# Altium schematic sheet SimpleFOCDriver.SchDoc
size A4
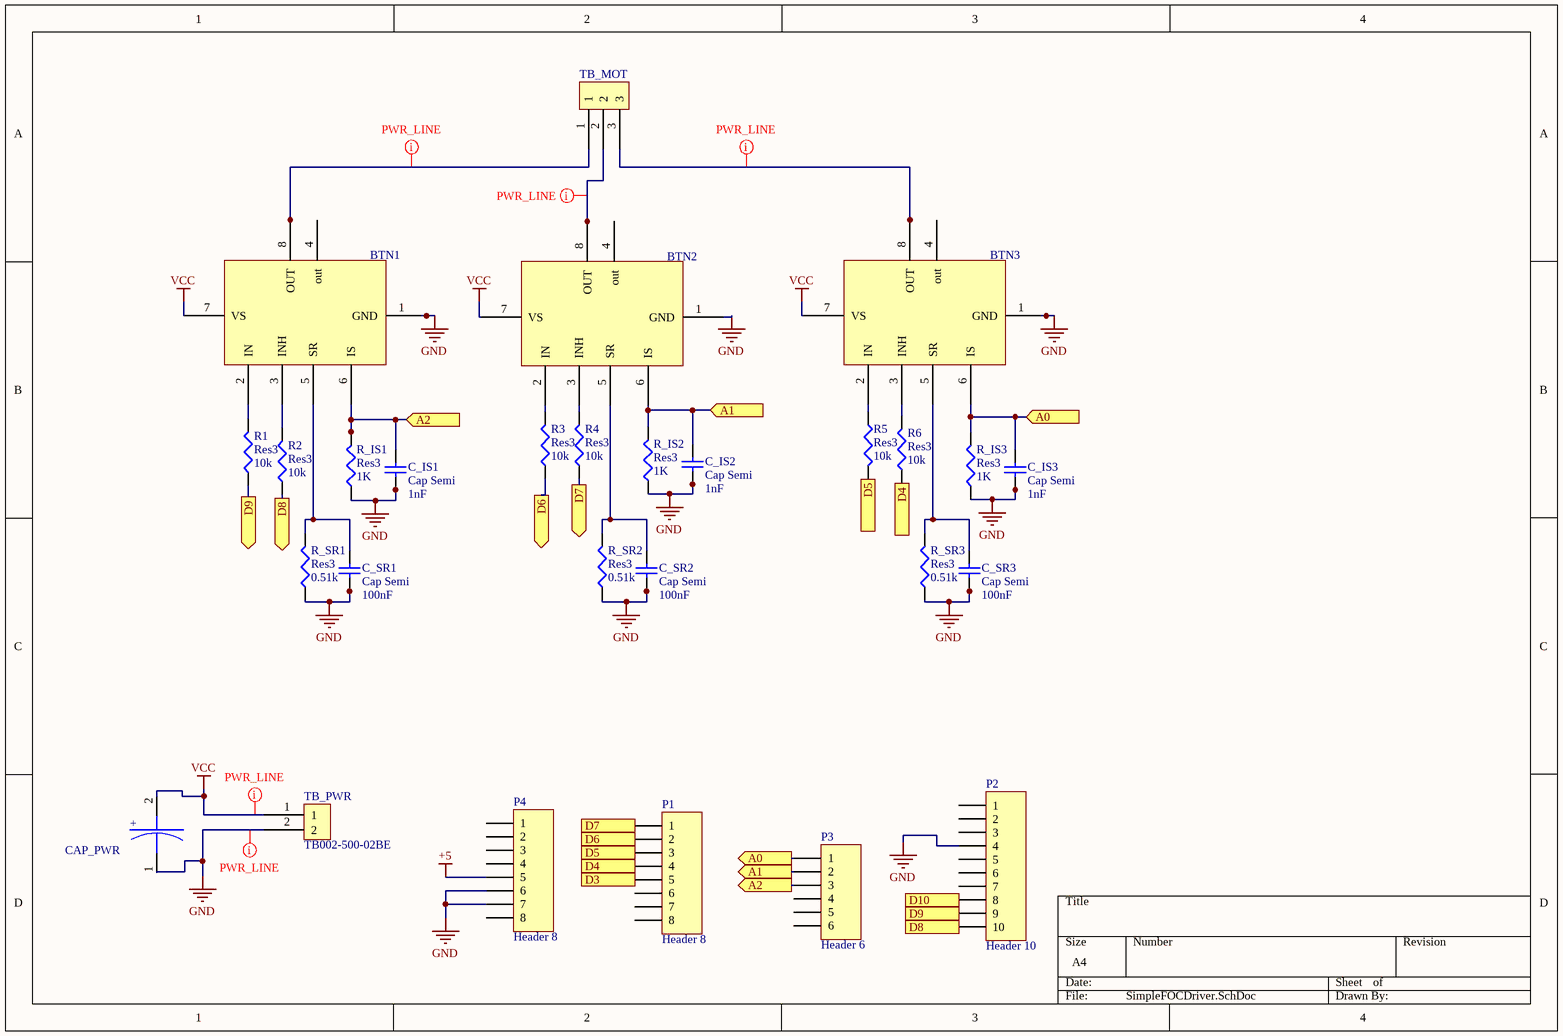
[diagram p0: SimpleFOCDriver.SchDoc]

## Parts
BTN1  BTN8982  [BTN8982]  (value not drawn)
BTN2  BTN8982  [BTN8982]  (value not drawn)
BTN3  BTN8982  [BTN8982]  (value not drawn)
C_IS1  Cap Semi  value 1nF  [1608[0603]]
C_IS2  Cap Semi  value 1nF  [1608[0603]]
C_IS3  Cap Semi  value 1nF  [1608[0603]]
C_SR1  Cap Semi  value 100nF  [1608[0603]]
C_SR2  Cap Semi  value 100nF  [1608[0603]]
C_SR3  Cap Semi  value 100nF  [1608[0603]]
CAP_PWR  VEJ471M1ETR1010  [VEJ471M1ETR1010]  (value not drawn)
P1  Header 8  [HDR1X8]
P2  Header 10  [HDR1X10]
P3  Header 6  [HDR1X6]
P4  Header 8  [HDR1X8]
R1  Res3  value 10k  [J1-0603]
R2  Res3  value 10k  [J1-0603]
R3  Res3  value 10k  [J1-0603]
R4  Res3  value 10k  [J1-0603]
R5  Res3  value 10k  [J1-0603]
R6  Res3  value 10k  [J1-0603]
R_IS1  Res3  value 1K  [J1-0603]
R_IS2  Res3  value 1K  [J1-0603]
R_IS3  Res3  value 1K  [J1-0603]
R_SR1  Res3  value 0.51k  [J1-0603]
R_SR2  Res3  value 0.51k  [J1-0603]
R_SR3  Res3  value 0.51k  [J1-0603]
TB_MOT  TB002-500-03BE  [TB002-500-03BE]  (value not drawn)
TB_PWR  TB002-500-02BE  [TB002-500-02BE]

## Ports
A0 (in), A0 (out), A1 (in), A1 (out), A2 (in), A2 (out), D3 (out), D4 (out), D5 (out), D6 (out), D7 (out), D8 (out), D9 (out), D10 (out)

## Nets
+5: P4.5
GND: BTN1.1(GND) BTN2.1(GND) BTN3.1(GND) C_IS1.1 C_IS2.1 C_IS3.1 C_SR1.1 C_SR2.1 C_SR3.1 CAP_PWR.1 P2.4 P4.6 P4.7 R_IS1.1 R_IS2.1 R_IS3.1 R_SR1.1 R_SR2.1 R_SR3.1 TB_PWR.2
VCC: BTN1.7(VS) BTN2.7(VS) BTN3.7(VS) CAP_PWR.2(+) TB_PWR.1
A0: BTN3.6(IS) C_IS3.2 P3.1 R_IS3.2 ; port A0
A1: BTN2.6(IS) C_IS2.2 P3.2 R_IS2.2 ; port A1
A2: BTN1.6(IS) C_IS1.2 P3.3 R_IS1.2 ; port A2
D3: P1.5 ; port D3
D4: P1.4 R6.1 ; port D4
D5: P1.3 R5.2 ; port D5
D6: P1.2 R3.1 ; port D6
D7: P1.1 R4.1 ; port D7
D8: P2.10 R2.1 ; port D8
D9: P2.9 R1.1 ; port D9
D10: P2.8 ; port D10
NetBTN1_2: BTN1.2(IN) R1.2
NetBTN1_3: BTN1.3(INH) R2.2
NetBTN1_5: BTN1.5(SR) C_SR1.2 R_SR1.2
NetBTN1_8: BTN1.8(OUT) TB_MOT.1
NetBTN2_2: BTN2.2(IN) R3.2
NetBTN2_3: BTN2.3(INH) R4.2
NetBTN2_5: BTN2.5(SR) C_SR2.2 R_SR2.2
NetBTN2_8: BTN2.8(OUT) TB_MOT.2
NetBTN3_2: BTN3.2(IN) R5.1
NetBTN3_3: BTN3.3(INH) R6.2
NetBTN3_5: BTN3.5(SR) C_SR3.2 R_SR3.2
NetBTN3_8: BTN3.8(OUT) TB_MOT.3

Not connected (* = marked no-connect by the designer): BTN1 4(out); BTN2 4(out); BTN3 4(out); P1 6 7 8; P2 1 2 3 5 6 7; P3 4 5 6; P4 1 2 3 4 8

## Layout directives
net class pwr_line: GND, NetBTN1_8, NetBTN2_8, NetBTN3_8, VCC

## Library data of the parts
C_IS1-C_IS3 C_SR1-C_SR3 = Cap Semi: Capacitor (Semiconductor SIM Model); Published: 8-Jun-2000; LatestRevisionDate: 29-May-2009; LatestRevisionNote: IPC-7351 Footprint Added.; PackageReference: C1206; Publisher: Altium Limited; PackageDescription: Chip Capacitor
P1 P4 = Header 8: Header, 8-Pin; LatestRevisionDate: 17-Jul-2002; LatestRevisionNote: Re-released for DXP Platform.; Publisher: Altium Limited
P2 = Header 10: Header, 10-Pin; LatestRevisionDate: 17-Jul-2002; LatestRevisionNote: Re-released for DXP Platform.; Publisher: Altium Limited
P3 = Header 6: Header, 6-Pin; LatestRevisionDate: 17-Jul-2002; LatestRevisionNote: Re-released for DXP Platform.; Publisher: Altium Limited
R1-R6 R_IS1-R_IS3 R_SR1-R_SR3 = Res3: Resistor; Published: 8-Jun-2000; LatestRevisionDate: 29-May-2009; LatestRevisionNote: IPC-7351 Footprint Added.; PackageReference: J1-0603; Publisher: Altium Limited; PackageDescription: Chip Resistor
BTN1-BTN3 = BTN8982: Supplier 1: RSComponents
CAP_PWR = VEJ471M1ETR1010: Supplier 1: Mouser; Supplier Part Number 1: 140-VEJ471M1ETR1010
TB_MOT = TB002-500-03BE: Supplier 1: Mouser; Supplier Part Number 1: 490-TB002-500-03BE
TB_PWR = TB002-500-02BE: Supplier 1: Mouser; Supplier Part Number 1: 490-TB002-500-02BE